# Altium schematic sheet Thermometer.SchDoc
size A4
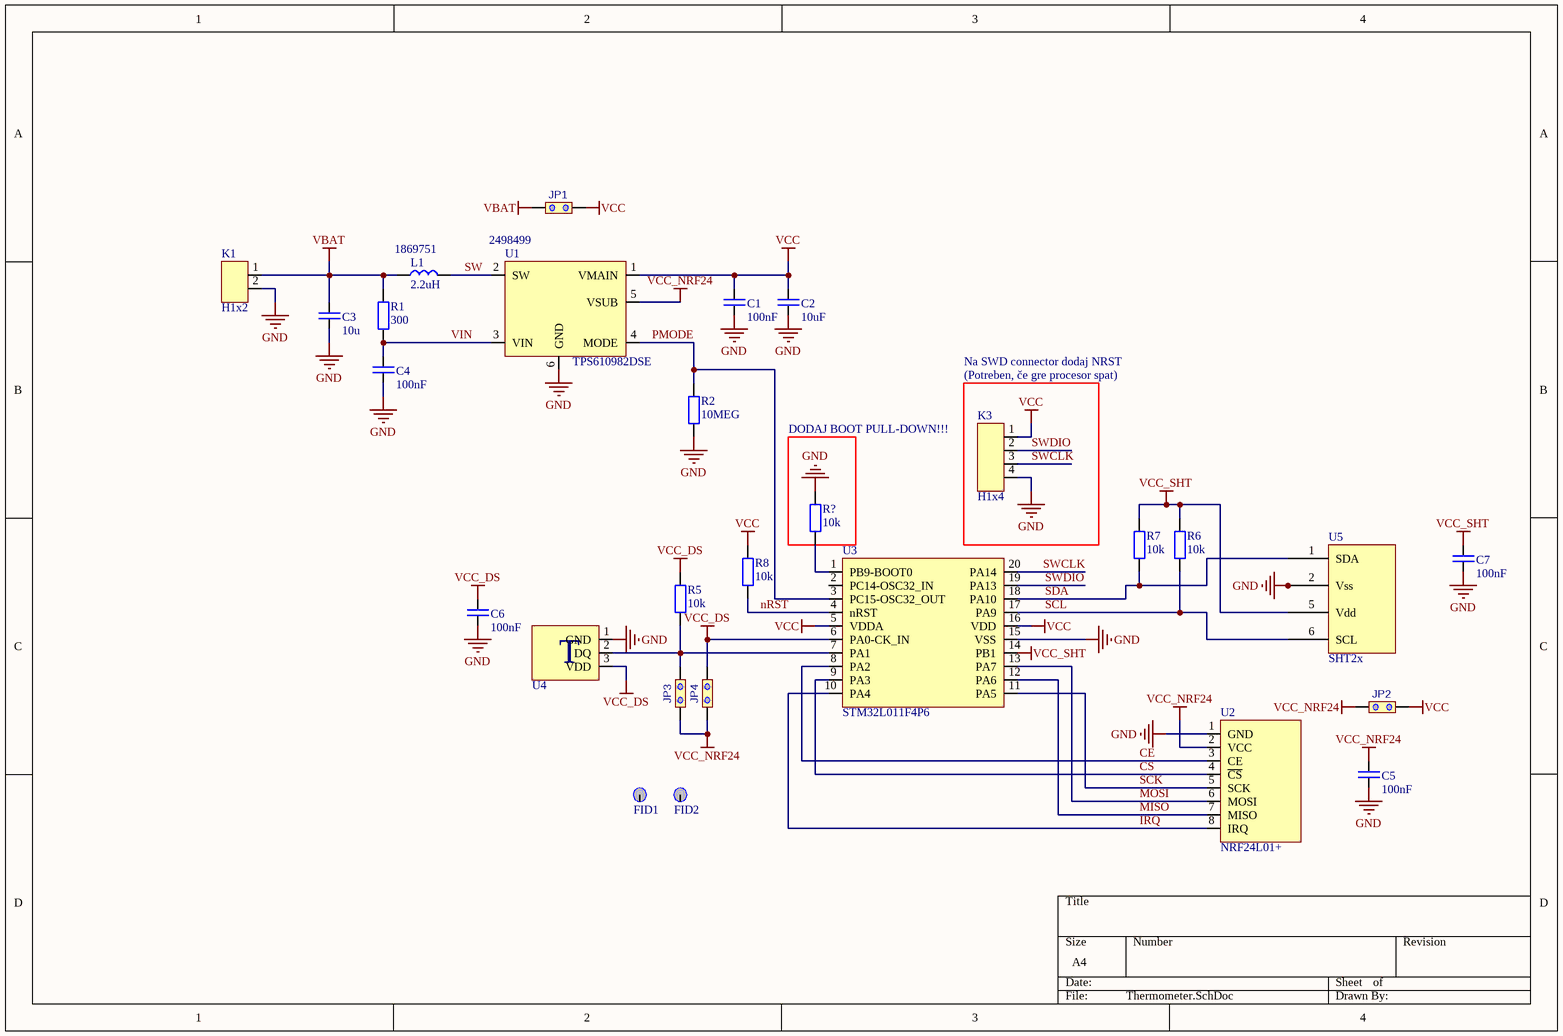
[diagram p0: Thermometer.SchDoc]

## Parts
C1  100nF  [C1608_0603I_M]
C2  10uF  [C2012_0805I_M]
C3  10u  [C2012_0805I_M]
C4  100nF  [C1608_0603I_M]
C5  100nF  [C1608_0603I_M]
C6  100nF  [C1608_0603I_M]
C7  100nF  [C1608_0603I_M]
FID1  Fiducial  [Fiducial]  (value not drawn)
FID2  Fiducial  [Fiducial]  (value not drawn)
JP1  JMP  [solderJumper]  (value not drawn)
JP2  JMP  [solderJumper]  (value not drawn)
JP3  JMP  [solderJumper]  (value not drawn)
JP4  JMP  [solderJumper]  (value not drawn)
K1  H1x2  [H1x2]
K3  H1x4  [H1x4]
L1  2.2uH  Supplier Part Number 1: 1869751  [R2012_0805I_M]
R1  300  [R1608_0603I_M]
R2  10MEG  [R1608_0603I_M]
R5  10k  [R1608_0603I_M]
R6  10k  [R1608_0603I_M]
R7  10k  [R1608_0603I_M]
R8  10k  [R1608_0603I_M]
R?  10k  [R1608_0603I_M]
U1  TPS610982DSE  Supplier Part Number 1: 2498499  [WSON6M]
U2  NRF24L01+  [NRF24L01+smd_module]
U3  STM32L011F4P6  [TSSOPM]
U4  DS18B20  [TO92]  (value not drawn)
U5  SHT2x  [DFN6]

## Blocks framed on the sheet
DODAJ BOOT PULL-DOWN!!!: R?

## Nets
GND: C1.2 C2.2 C3.2 C4.2 C5.2 C6.2 C7.2 K1.2 K3.4 R2.2 R?.1 U1.6(GND) U2.1(GND) U3.15(VSS) U4.1(GND) U5.0(power_pad) U5.2(Vss)
VBAT: C3.1 JP1.2 K1.1 L1.1 R1.1
VCC: C1.1 C2.1 JP1.1 JP2.1 K3.1 R8.1 U1.1(VMAIN) U3.5(VDDA) U3.16(VDD)
VCC_DS: C6.1 JP4.1 R5.1 U3.6(PA0-CK_IN) U4.3(VDD)
VCC_NRF24: C5.1 JP2.2 JP3.2 JP4.2 U1.5(VSUB) U2.2(VCC)
VCC_SHT: C7.1 R6.1 R7.1 U3.14(PB1) U5.5(Vdd)
CE: U2.3(CE) U3.8(PA2)
CS: U2.4(~{CS}) U3.9(PA3)
IRQ: U2.8(IRQ) U3.10(PA4)
MISO: U2.7(MISO) U3.12(PA6)
MOSI: U2.6(MOSI) U3.13(PA7)
nRST: R8.2 U3.4(nRST)
PMODE: R2.1 U1.4(MODE) U3.3(PC15-OSC32_OUT)
SCK: U2.5(SCK) U3.11(PA5)
SCL: R6.2 U3.17(PA9) U5.6(SCL)
SDA: R7.2 U3.18(PA10) U5.1(SDA)
SW: L1.2 U1.2(SW)
SWCLK: K3.3 U3.20(PA14)
SWDIO: K3.2 U3.19(PA13)
VIN: C4.1 R1.2 U1.3(VIN)
NetJP3_1: JP3.1 R5.2 U3.7(PA1) U4.2(DQ)
NetR?_2: R?.2 U3.1(PB9-BOOT0)

Not connected (* = marked no-connect by the designer): FID1 F; FID2 F; U3 2(PC14-OSC32_IN)

## Notes on the sheet
- Na SWD connector dodaj NRST
- (Potreben, če gre procesor spat)
- (in symbol DS18B20) T

## Library data of the parts
C1-C7 = C: Capacitor
FID1 FID2 = Fiducial: according to IPC-7351 - is a 1mm diameter round dot with 2mm solder mask opening; Voltage: 50V; Tolerance: 5%; max.Temperature: +125; min.Temperature: -40
JP1-JP4 = JMP: Value: {Value}
K1 = H1x2: Header 1x2 (male)
K3 = H1x4: Header 1x4 (male)
L1 = L: Supplier 1: Farnell
R1 R2 R5-R8 R? = R
U2 = NRF24L01+: 2.4GHz low power, long range module
U4 = DS18B20: Temperature sensor 1-wire interface
U5 = SHT2x: Voltage: 50V; Tolerance: 5%; max.Temperature: +125; min.Temperature: -40
U1 = TPS610982DSE: Supplier 1: Farnell